# Altium schematic sheet SecurityHost_v2.0.SchDoc
size A2; SheetNumber: 1; SheetTotal: 1
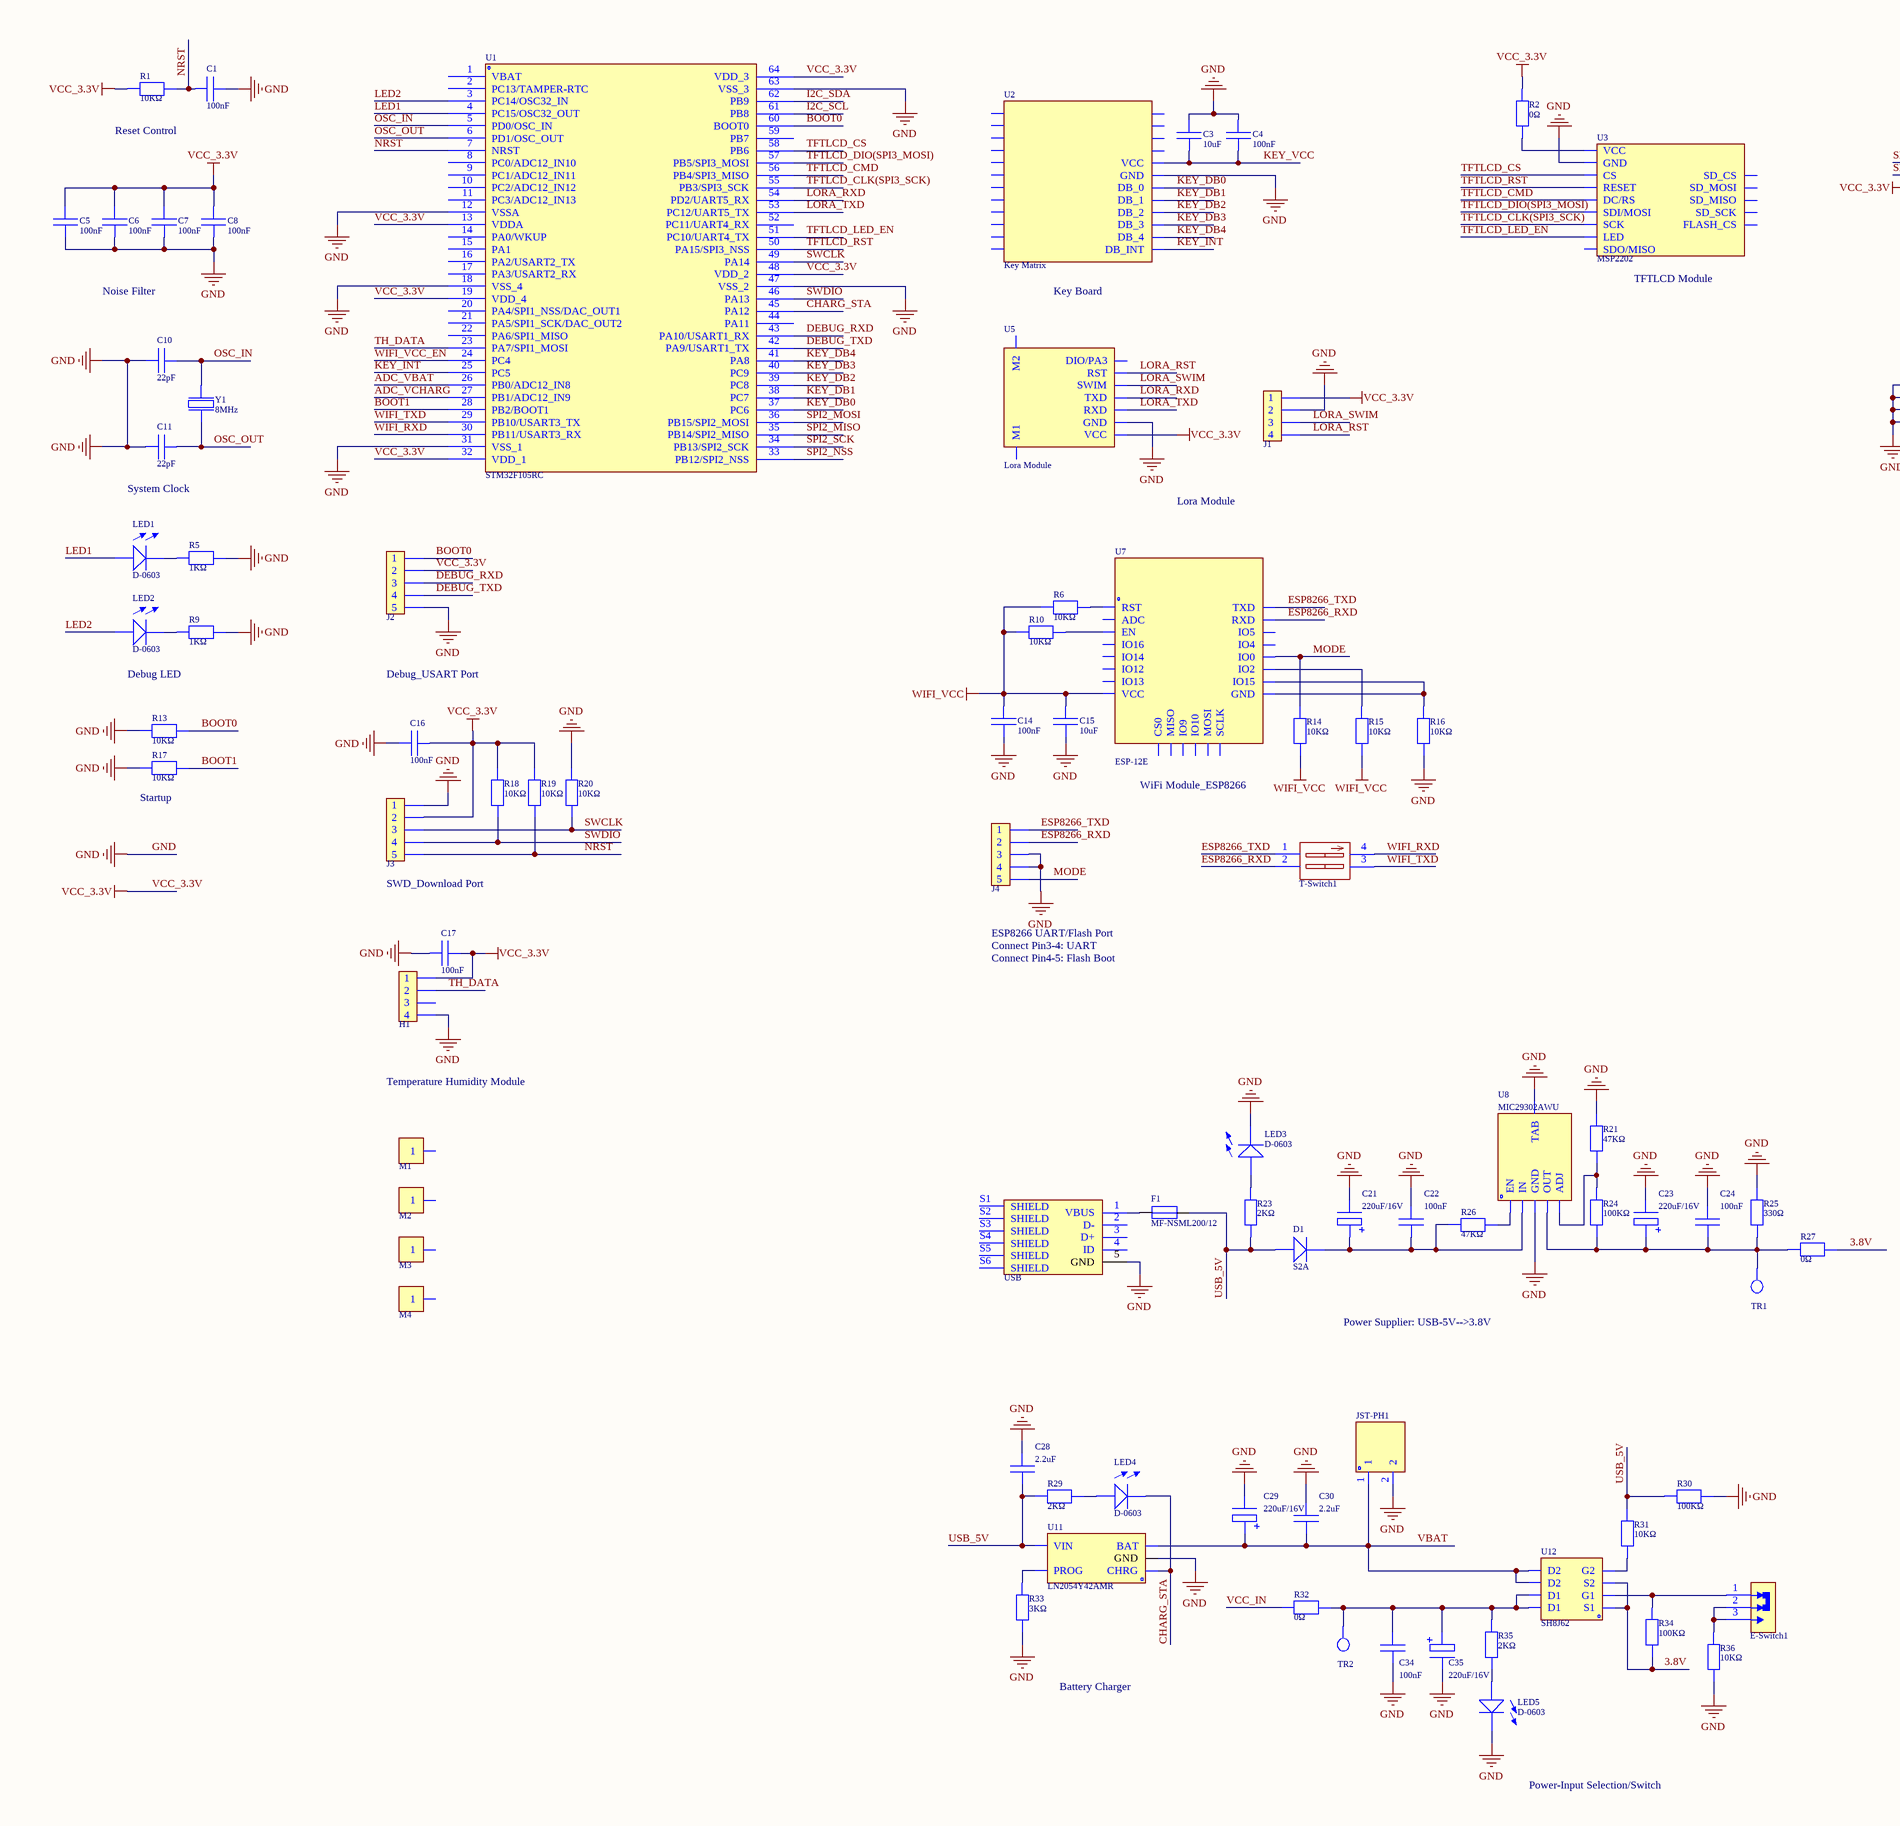
[diagram p0: SecurityHost_v2.0.SchDoc, left]
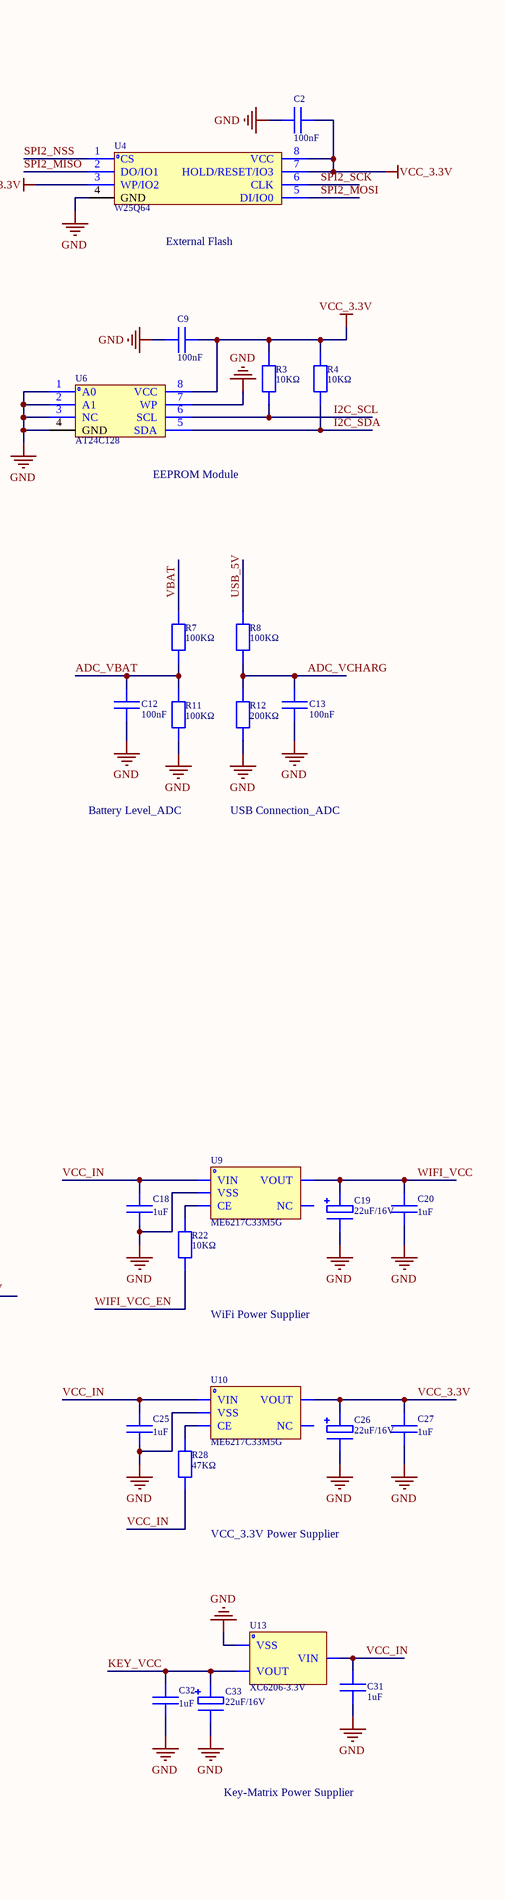
[diagram p1: SecurityHost_v2.0.SchDoc, right]

## Parts
C1  100nF  [C0603]
C2  100nF  [C0603]
C3  10uF  [C0603]
C4  100nF  [C0603]
C5  100nF  [C0603]
C6  100nF  [C0603]
C7  100nF  [C0603]
C8  100nF  [C0603]
C9  100nF  [C0603]
C10  22pF  [C0603]
C11  22pF  [C0603]
C12  100nF  [C0603]
C13  100nF  [C0603]
C14  100nF  [C0603]
C15  10uF  [C0603]
C16  100nF  [C0603]
C17  100nF  [C0603]
C18  1uF  [C0603]
C19  22uF/16V  [C(Electrolytic)_SMD-D4.0mm_L5.4mm]
C20  1uF  [C0603]
C21  220uF/16V  [C(Electrolytic)_SMD-D6.3mm_L7.7mm]
C22  100nF  [C0603]
C23  220uF/16V  [C(Electrolytic)_SMD-D6.3mm_L7.7mm]
C24  100nF  [C0603]
C25  1uF  [C0603]
C26  22uF/16V  [C(Electrolytic)_SMD-D4.0mm_L5.4mm]
C27  1uF  [C0603]
C28  2.2uF  [C0603]
C29  220uF/16V  [C(Electrolytic)_SMD-D6.3mm_L7.7mm]
C30  2.2uF  [C0603]
C31  1uF  [C0603]
C32  1uF  [C0603]
C33  22uF/16V  [C(Electrolytic)_SMD-D4.0mm_L5.4mm]
C34  100nF  [C0603]
C35  220uF/16V  [C(Electrolytic)_SMD-D6.3mm_L7.7mm]
D1  S2A  [SMB_L4.3-W3.6]
E-Switch1  E-Switch_3Pin-Slide  [E-Switch_3Pin-Slide]  (value not drawn)
F1  MF-NSML200/12  [Fuse_SMD_1206]
H1  Soldering Hole_4Pin-2.54mm  [Soldering Hole_4Pin-2.54mm]  (value not drawn)
J1  PinHeader_4Pin  [PinHeader_4Pin-2.54mm]  (value not drawn)
J2  PinHeader_5Pin  [PinHeader_5Pin-2.54mm]  (value not drawn)
J3  PinHeader_5Pin  [PinHeader_5Pin-2.54mm]  (value not drawn)
J4  PinHeader_5Pin  [PinHeader_5Pin-2.54mm]  (value not drawn)
JST-PH1  JST-PH2.0_2Pin-TH-Vertical  [Connector-JST-PH2.0-2Pin_TH-Vertical]  (value not drawn)
LED1  D-0603  [LED0603-Castellated]
LED2  D-0603  [LED0603-Castellated]
LED3  D-0603  [LED0603-Castellated]
LED4  D-0603  [LED0603-Castellated]
LED5  D-0603  [LED0603-Castellated]
M1  PCB Mounting Hole  [PCB Mounting Hole]  (value not drawn)
M2  PCB Mounting Hole  [PCB Mounting Hole]  (value not drawn)
M3  PCB Mounting Hole  [PCB Mounting Hole]  (value not drawn)
M4  PCB Mounting Hole  [PCB Mounting Hole]  (value not drawn)
R1  10KΩ  [R0603]
R2  0Ω  [R0805]
R3  10KΩ  [R0603]
R4  10KΩ  [R0603]
R5  1KΩ  [R0603]
R6  10KΩ  [R0603]
R7  100KΩ  [R0603]
R8  100KΩ  [R0603]
R9  1KΩ  [R0603]
R10  10KΩ  [R0603]
R11  100KΩ  [R0603]
R12  200KΩ  [R0603]
R13  10KΩ  [R0603]
R14  10KΩ  [R0603]
R15  10KΩ  [R0603]
R16  10KΩ  [R0603]
R17  10KΩ  [R0603]
R18  10KΩ  [R0603]
R19  10KΩ  [R0603]
R20  10KΩ  [R0603]
R21  47KΩ  [R0603]
R22  10KΩ  [R0603]
R23  2KΩ  [R0603]
R24  100KΩ  [R0603]
R25  330Ω  [R0603]
R26  47KΩ  [R0603]
R27  0Ω  [R0805]
R28  47KΩ  [R0603]
R29  2KΩ  [R0603]
R30  100KΩ  [R0603]
R31  10KΩ  [R0603]
R32  0Ω  [R0805]
R33  3KΩ  [R0603]
R34  100KΩ  [R0603]
R35  2KΩ  [R0603]
R36  10KΩ  [R0603]
T-Switch1  DSHP02TSGET  [Toggle-Switch_2Bit-4Pin_SMD]  (value not drawn)
TR1  Test Ring  [Test Ring_TH-BD2.54mm]  (value not drawn)
TR2  Test Ring  [Test Ring_TH-BD2.54mm]  (value not drawn)
U1  STM32F105RC  [LQFP_64Pin_L10.0-W10.0-P0.5]
U2  Key Matrix  [Key Matrix Module_16Key_Tactile]
U3  MSP2202  [LCD_TFT_SPI_2.2inch_ILI9341]
U4  W25Q64  [SOIC_8Pin-L5.3-W5.3]
U5  Lora Module  [Lora Module_SX1278/STM8]
U6  AT24C128  [SOIC_8Pin-L5.0-W4.0]
U7  ESP-12E  [ESP8266-12E/ESP-12E_Ai Thinker]
U8  MIC29302AWU  [TO-263-5_Tab-Pin6_L10.3-W8.9]
U9  ME6217C33M5G  [SOT-23-5_L3.0-W1.7]
U10  ME6217C33M5G  [SOT-23-5_L3.0-W1.7]
U11  LN2054Y42AMR  [SOT-23-5_L3.0-W1.7]
U12  SH8J62  [SOIC_8Pin-L5.0-W4.0]
U13  XC6206-3.3V  [SOT-23-3]
USB  USB_Micro-B-Molex  [USB_Micro-B]  (value not drawn)
Y1  8MHz  [Crystal_TH_HC-49S-L11.5-W4.5]

## Nets
GND: C1.1 C2.1 C3.2 C4.2 C5.1 C6.1 C7.1 C8.1 C9.1 C10.1 C11.1 C12.1 C13.1 C14.2 C15.2 C16.1 C17.2 C18.1 C19.2 C20.1 C21.2 C22.2 C23.2 C24.2 C25.1 C26.2 C27.1 C28.2 C29.2 C30.2 C31.2 C32.1 C33.2 C34.1 C35.2 H1.4 J1.2 J2.5 J3.1 J4.3 J4.4 JST-PH1.2 LED3.2 LED5.2 R5.2 R9.2 R11.1 R12.1 R13.1 R16.1 R17.1 R20.2 R21.2 R25.2 R30.1 R33.1 R36.1 U1.12(VSSA) U1.18(VSS_4) U1.31(VSS_1) U1.47(VSS_2) U1.63(VSS_3) U2.6(GND) U3.2(GND) U4.4(GND) U5.2(GND) U6.1(A0) U6.2(A1) U6.3(NC) U6.4(GND) U6.7(WP) U8.3(GND) U8.6(TAB) U9.2(VSS) U10.2(VSS) U11.2(GND) U13.1(VSS) USB.5(GND)
VCC_3.3V: C2.2 C5.2 C6.2 C7.2 C8.2 C9.2 C16.2 C17.1 C26.1 C27.2 H1.1 J1.1 J2.2 J3.2 R1.2 R2.2 R3.2 R4.2 R18.2 R19.2 U1.13(VDDA) U1.19(VDD_4) U1.32(VDD_1) U1.48(VDD_2) U1.64(VDD_3) U4.3(WP/IO2) U4.7(HOLD/RESET/IO3) U4.8(VCC) U5.1(VCC) U6.8(VCC) U10.5(VOUT)
WIFI_VCC: C14.1 C15.1 C19.1 C20.2 R6.2 R10.1 R14.1 R15.1 U7.8(VCC) U9.5(VOUT)
3.8V: R27.2 R34.1 U12.1(S1) U12.3(S2)
ADC_VBAT: C12.2 R7.1 R11.2 U1.26(PB0/ADC12_IN8)
ADC_VCHARG: C13.2 R8.1 R12.2 U1.27(PB1/ADC12_IN9)
BOOT0: J2.1 R13.2 U1.60(BOOT0)
BOOT1: R17.2 U1.28(PB2/BOOT1)
CHARG_STA: LED4.2 U1.45(PA12) U11.1(CHRG)
DEBUG_RXD: J2.3 U1.43(PA10/USART1_RX)
DEBUG_TXD: J2.4 U1.42(PA9/USART1_TX)
ESP8266_RXD: J4.2 T-Switch1.2 U7.21(RXD)
ESP8266_TXD: J4.1 T-Switch1.1 U7.22(TXD)
I2C_SCL: R3.1 U1.61(PB8) U6.6(SCL)
I2C_SDA: R4.1 U1.62(PB9) U6.5(SDA)
KEY_DB0: U1.37(PC6) U2.7(DB_0)
KEY_DB1: U1.38(PC7) U2.8(DB_1)
KEY_DB2: U1.39(PC8) U2.9(DB_2)
KEY_DB3: U1.40(PC9) U2.10(DB_3)
KEY_DB4: U1.41(PA8) U2.11(DB_4)
KEY_INT: U1.25(PC5) U2.12(DB_INT)
KEY_VCC: C3.1 C4.1 C32.2 C33.1 U2.5(VCC) U13.2(VOUT)
LED1: LED1.1 U1.4(PC15/OSC32_OUT)
LED2: LED2.1 U1.3(PC14/OSC32_IN)
LORA_RST: J1.4 U5.6(RST)
LORA_RXD: U1.54(PD2/UART5_RX) U5.4(TXD)
LORA_SWIM: J1.3 U5.5(SWIM)
LORA_TXD: U1.53(PC12/UART5_TX) U5.3(RXD)
MODE: J4.5 R14.2 U7.18(IO0)
NRST: C1.2 J3.5 R1.1 R19.1 U1.7(NRST)
OSC_IN: C10.2 U1.5(PD0/OSC_IN) Y1.2
OSC_OUT: C11.2 U1.6(PD1/OSC_OUT) Y1.1
SPI2_MISO: U1.35(PB14/SPI2_MISO) U4.2(DO/IO1)
SPI2_MOSI: U1.36(PB15/SPI2_MOSI) U4.5(DI/IO0)
SPI2_NSS: U1.33(PB12/SPI2_NSS) U4.1(CS)
SPI2_SCK: U1.34(PB13/SPI2_SCK) U4.6(CLK)
SWCLK: J3.3 R20.1 U1.49(PA14)
SWDIO: J3.4 R18.1 U1.46(PA13)
TFTLCD_CLK(SPI3_SCK): U1.55(PB3/SPI3_SCK) U3.7(SCK)
TFTLCD_CMD: U1.56(PB4/SPI3_MISO) U3.5(DC/RS)
TFTLCD_CS: U1.58(PB6) U3.3(CS)
TFTLCD_DIO(SPI3_MOSI): U1.57(PB5/SPI3_MOSI) U3.6(SDI/MOSI)
TFTLCD_LED_EN: U1.51(PC10/UART4_TX) U3.8(LED)
TFTLCD_RST: U1.50(PA15/SPI3_NSS) U3.4(RESET)
TH_DATA: H1.2 U1.23(PA7/SPI1_MOSI)
USB_5V: C28.1 D1.2 F1.2 R8.2 R23.1 R29.2 R30.2 R31.2 U11.4(VIN)
VBAT: C29.1 C30.1 JST-PH1.1 R7.2 U11.3(BAT) U12.5(D2) U12.6(D2)
VCC_IN: C18.2 C25.2 C31.1 R28.2 R32.1 U9.1(VIN) U10.1(VIN) U13.3(VIN)
WIFI_RXD: T-Switch1.4 U1.30(PB11/USART3_RX)
WIFI_TXD: T-Switch1.3 U1.29(PB10/USART3_TX)
WIFI_VCC_EN: R22.2 U1.24(PC4)
NetC21_1: C21.1 C22.1 D1.1 R26.1 U8.2(IN)
NetC23_1: C23.1 C24.1 R24.1 R25.1 R27.1 TR1.1 U8.4(OUT)
NetC34_2: C34.2 C35.1 R32.2 R35.2 TR2.1 U12.7(D1) U12.8(D1)
NetE-Switch1_1: E-Switch1.1(NC) R34.2 U12.2(G1)
NetE-Switch1_2: E-Switch1.2(COM) E-Switch1.3(NO) R36.2
NetF1_1: F1.1 USB.1(VBUS)
NetLED1_2: LED1.2 R5.1
NetLED2_2: LED2.2 R9.1
NetLED3_1: LED3.1 R23.2
NetLED4_1: LED4.1 R29.1
NetLED5_1: LED5.1 R35.1
NetR2_1: R2.1 U3.1(VCC)
NetR6_1: R6.1 U7.1(RST)
NetR10_2: R10.2 U7.3(EN)
NetR15_2: R15.2 U7.17(IO2)
NetR16_2: R16.2 U7.15(GND) U7.16(IO15)
NetR21_1: R21.1 R24.2 U8.5(ADJ)
NetR22_1: R22.1 U9.3(CE)
NetR26_2: R26.2 U8.1(EN)
NetR28_1: R28.1 U10.3(CE)
NetR31_1: R31.1 U12.4(G2)
NetR33_2: R33.2 U11.5(PROG)

Not connected (* = marked no-connect by the designer): H1 3; M1 1; M2 1; M3 1; M4 1; U1 1(VBAT) 2(PC13/TAMPER-RTC) 8(PC0/ADC12_IN10) 9(PC1/ADC12_IN11) 10(PC2/ADC12_IN12) 11(PC3/ADC12_IN13) 14(PA0/WKUP) 15(PA1) 16(PA2/USART2_TX) 17(PA3/USART2_RX) 20(PA4/SPI1_NSS/DAC_OUT1) 21(PA5/SPI1_SCK/DAC_OUT2) 22(PA6/SPI1_MISO) 44(PA11) 52(PC11/UART4_RX) 59(PB7); U2 1 2 3 4 13 14 15 16 17 18 19 20 21 22 23 24; U3 9(SDO/MISO) 10(SD_CS) 11(SD_MOSI) 12(SD_MISO) 13(SD_SCK) 14(FLASH_CS); U5 7(DIO/PA3) 8(M1) 9(M2); U7 2(ADC) 4(IO16) 5(IO14) 6(IO12) 7(IO13) 9(CS0) 10(MISO) 11(IO9) 12(IO10) 13(MOSI) 14(SCLK) 19(IO4) 20(IO5); U9 4(NC); U10 4(NC); USB 2(D-) 3(D+) 4(ID) S1(SHIELD) S2(SHIELD) S3(SHIELD) S4(SHIELD) S5(SHIELD) S6(SHIELD)

## Notes on the sheet
- Reset Control
- (near U4) External Flash
- Noise Filter
- Key Board
- (near U3) TFTLCD Module
- (near C11) System Clock
- (near U6) EEPROM Module
- Lora Module
- Debug LED
- Debug_USART Port
- (near R17) Startup
- (near U7) WiFi Module_ESP8266
- Battery Level_ADC
- USB Connection_ADC
- (near J3) SWD_Download Port
- ESP8266 UART/Flash Port
- Connect Pin4-5: Flash Boot
- Connect Pin3-4: UART
- Temperature Humidity Module
- WiFi Power Supplier
- Power Supplier: USB-5V-->3.8V
- VCC_3.3V Power Supplier
- Battery Charger
- Key-Matrix Power Supplier
- Power-Input Selection/Switch
- Labels drawn without touching a wire or pin: \

## Library data of the parts
C1-C18 C20 C22 C24 C25 C27 C28 C30-C32 C34 = Capacitor_0603
  C1 C2 C4-C9 C12-C14 C16 C17 C22 C24 C34: Value: 100nF
  C3 C15: Value: 10uF
  C10 C11: Value: 22pF
  C18 C20 C25 C27 C31 C32: Value: 1uF
  C28 C30: Value: 2.2uF
C19 C26 C33 = Capacitor_Electrolytic-SMD-D4.0xL5.4mm: Value: 22uF/16V
C21 C23 C29 C35 = Capacitor_Electrolytic-SMD-D6.3xL7.7mm: Value: 220uF/16V
D1 = Diode-Rectifier_SMB: Value: S2A
F1 = Fuse_SMD_1206: Value: MF-NSML200/12
J1 = PinHeader_4Pin: Straight Single Row, Square Pitch, 2.54mm
J2-J4 = PinHeader_5Pin: Straight Single Row, Square Pitch, 2.54mm
LED1-LED5 = LED_0603: Value: D-0603
M1-M4 = PCB Mounting Hole: Mounting Hole
R1 R3-R26 R28-R31 R33-R36 = Resistor_0603
  R1 R3 R4 R6 R10 R13-R20 R22 R31 R36: Value: 10KΩ
  R5 R9: Value: 1KΩ
  R7 R8 R11 R24 R30 R34: Value: 100KΩ
  R12: Value: 200KΩ
  R21 R26 R28: Value: 47KΩ
  R23 R29 R35: Value: 2KΩ
  R25: Value: 330Ω
  R33: Value: 3KΩ
R2 R27 R32 = Resistor_0805: Value: 0Ω
T-Switch1 = Toggle-Switch_2Bit-4Pin_SMD: Value: DSHP02TSGET
U1 = STM32F105_LQFP-64Pin-10x10mm: Value: STM32F105RC
U2 = Key Matrix Module_16Key
U3 = LCD_TFT_SPI_2.2inch_ILI9341: PinSocket on board for MSP2202 LCD-TFT Module
U4 = Flash_W25Q64_SOP8: Value: W25Q64
U5 = Lora Module_SX1278/STM8
U6 = EEPROM_AT24C128_SOP8: Value: AT24C128
U7 = ESP8266-12E/ESP-12E_Ai Thinker
U8 = LDO_TO-263-5: Tab-Pin6, 3A Fast Response LDO; Value: MIC29302AWU
U9 U10 = LDO_SOT23-5: Value: ME6217C33M5G
U11 = LN2054: LN2054Y42AMR, Linear Li-Ion Battery Charger; Value: LN2054Y42AMR
U12 = P-Channel_MOSFET_SOP8: Value: SH8J62
U13 = LDO_SOT23-3: Value: XC6206-3.3V
Y1 = Crystal_2Pin_TH: Value: 8MHz